# EAGLE design DACBRDV31 (EAGLE 5.07)
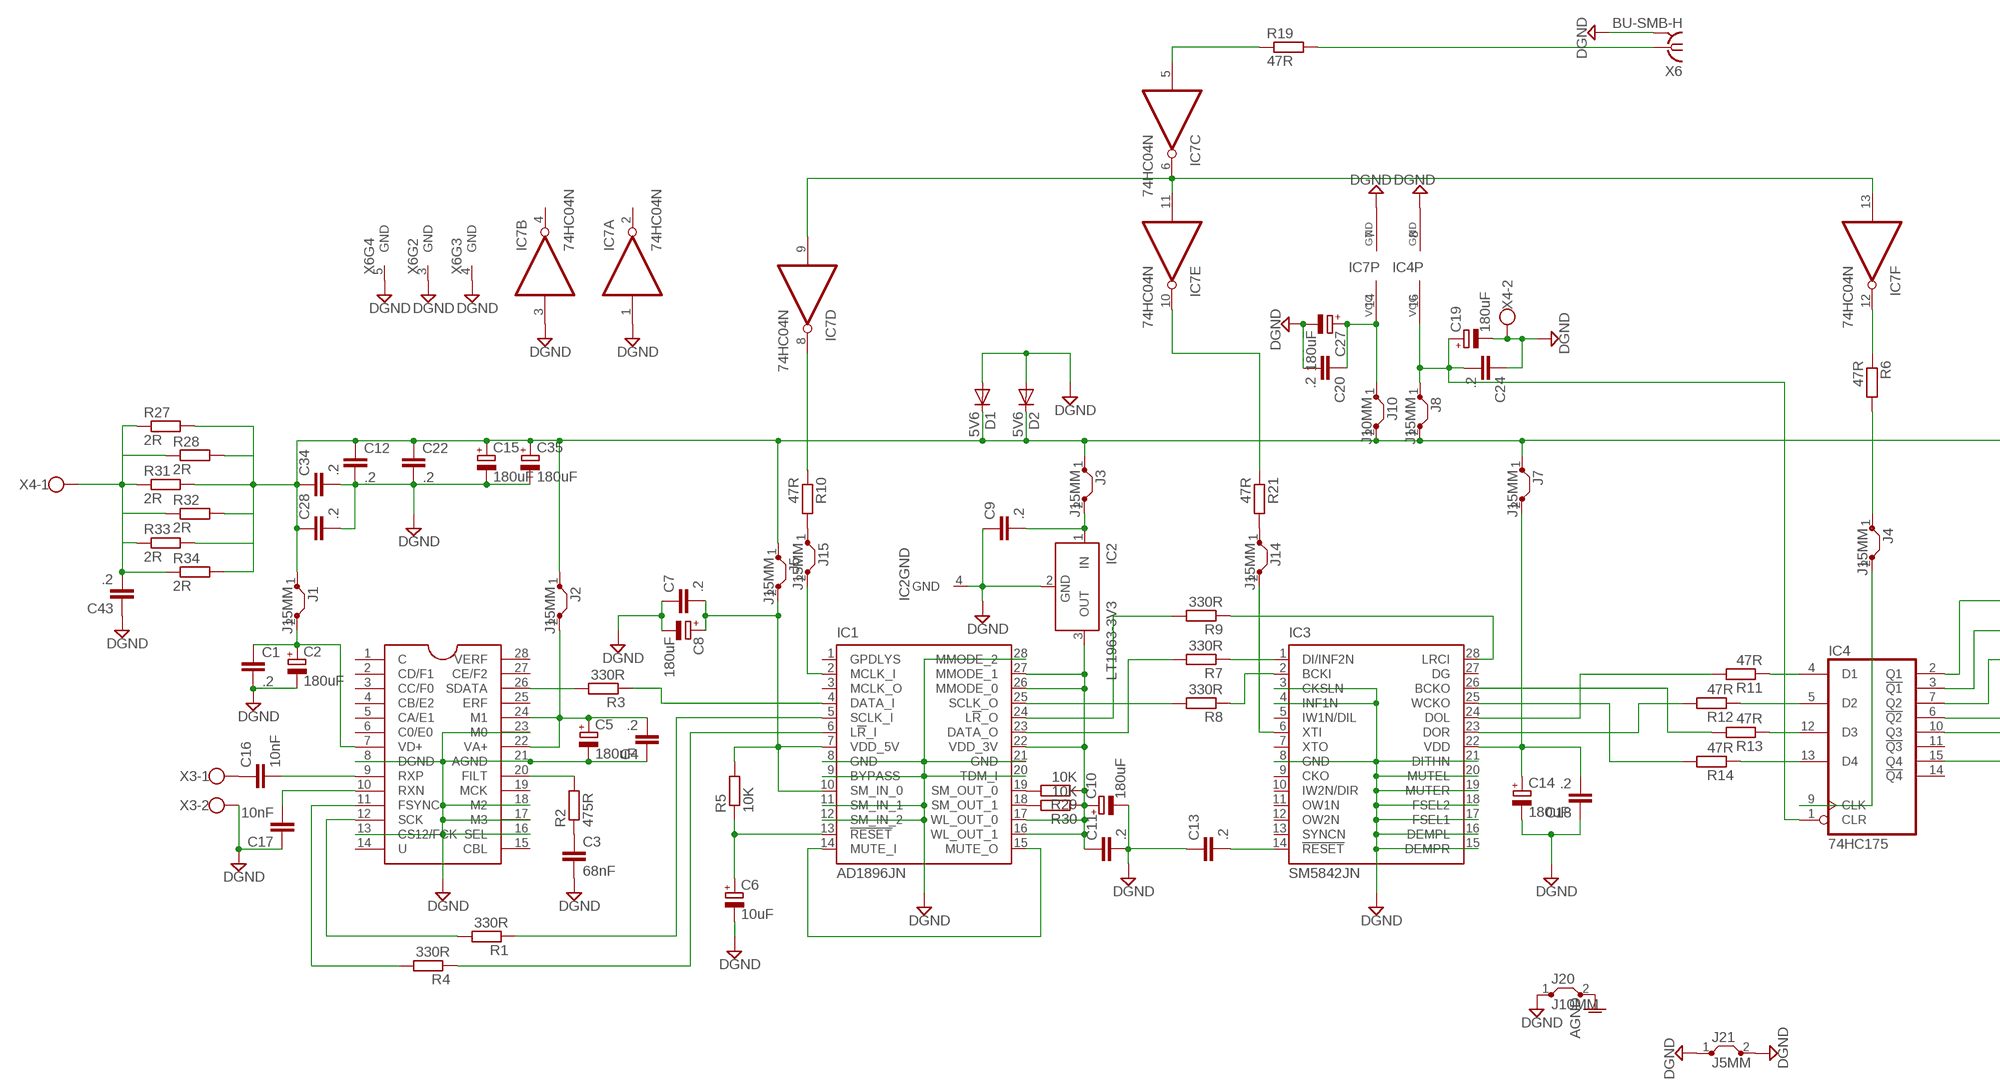
[diagram p0: schematic, sheet 1, part 1 of 2]
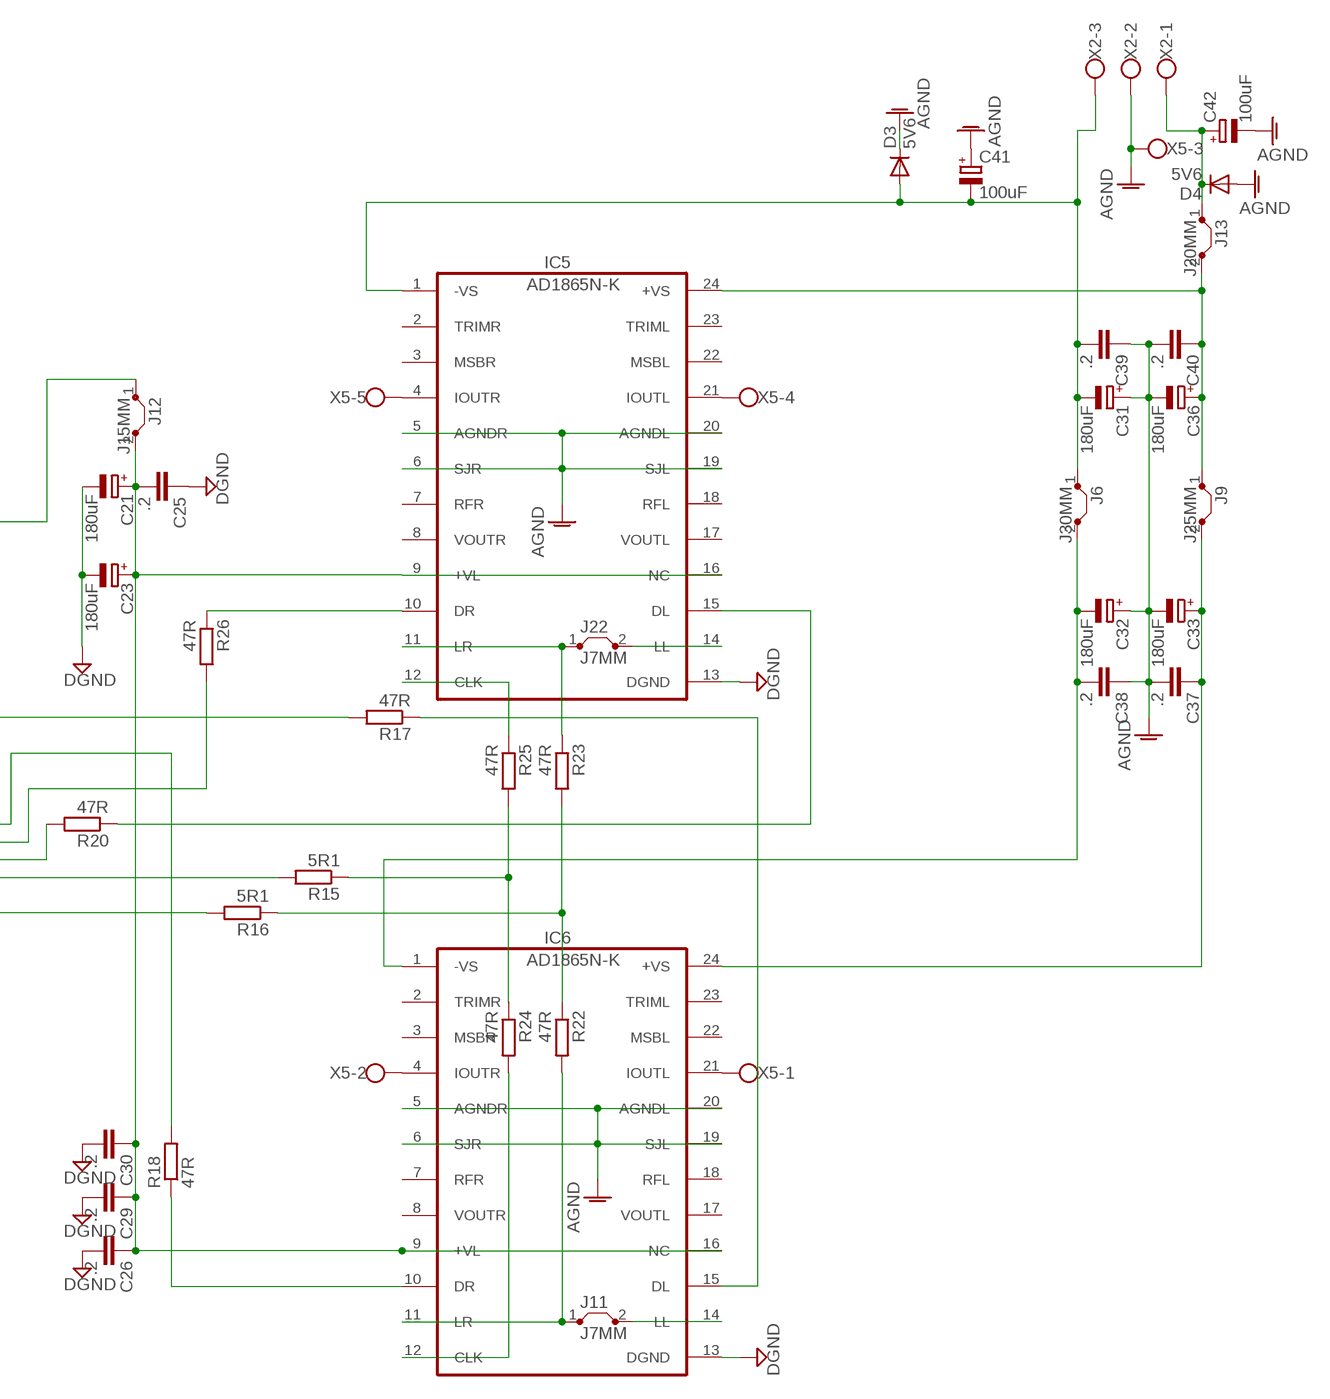
[diagram p1: schematic, sheet 1, part 2 of 2]

## Parts
C1  .2  C-EUC1210K  [C1210K]
C2  180uF  CPOL-EUE3.5-8  [E3,5-8]
C3  68nF  C-EU050-075X075  [C050-075X075]
C4  .2  C-EUC1210K  [C1210K]
C5  180uF  CPOL-EUE3.5-8  [E3,5-8]
C6  10uF  CPOL-EUE3.5-8  [E3,5-8]
C7  .2  C-EUC1210K  [C1210K]
C8  180uF  CPOL-EUE3.5-8  [E3,5-8]
C9  .2  C-EUC1210K  [C1210K]
C10  180uF  CPOL-EUE3.5-8  [E3,5-8]
C11  .2  C-EUC1210K  [C1210K]
C12  .2  C-EUC1210K  [C1210K]
C13  .2  C-EUC1210K  [C1210K]
C14  180uF  CPOL-EUE3.5-8  [E3,5-8]
C15  180uF  CPOL-EUE3.5-8  [E3,5-8]
C16  10nF  C-EU050-055X075  [C050-055X075]
C17  10nF  C-EU050-055X075  [C050-055X075]
C18  .2  C-EUC1210K  [C1210K]
C19  180uF  CPOL-EUE3.5-8  [E3,5-8]
C20  .2  C-EUC1210K  [C1210K]
C21  180uF  CPOL-EUE3.5-8  [E3,5-8]
C22  .2  C-EUC1210K  [C1210K]
C23  180uF  CPOL-EUE3.5-8  [E3,5-8]
C24  .2  C-EUC1210K  [C1210K]
C25  .2  C-EUC1210K  [C1210K]
C26  .2  C-EUC1210K  [C1210K]
C27  180uF  CPOL-EUE3.5-8  [E3,5-8]
C28  .2  C-EUC1210K  [C1210K]
C29  .2  C-EUC1210K  [C1210K]
C30  .2  C-EUC1210K  [C1210K]
C31  180uF  CPOL-EUE3.5-8  [E3,5-8]
C32  180uF  CPOL-EUE3.5-8  [E3,5-8]
C33  180uF  CPOL-EUE3.5-8  [E3,5-8]
C34  .2  C-EUC1210K  [C1210K]
C35  180uF  CPOL-EUE3.5-8  [E3,5-8]
C36  180uF  CPOL-EUE3.5-8  [E3,5-8]
C37  .2  C-EUC1210K  [C1210K]
C38  .2  C-EUC1210K  [C1210K]
C39  .2  C-EUC1210K  [C1210K]
C40  .2  C-EUC1210K  [C1210K]
C41  100uF  CPOL-EUE5-10.5  [E5-10,5]
C42  100uF  CPOL-EUE5-10.5  [E5-10,5]
C43  .2  C-EUC1210K  [C1210K]
D1  5V6  A114  [DO204-10]
D2  5V6  A114  [DO204-10]
D3  5V6  A114  [DO204-10]
D4  5V6  A114  [DO204-10]
IC1  AD1896JN  [DIL28-6]
IC2  LT1963-3V3  LT1129CST5  [SOT223]
IC3  SM5842JN  [DIL28-6]
IC4  74HC175  74175N  [DIL16]
IC5  AD1865N-K  AD1865  [DIL24-6]
IC6  AD1865N-K  AD1865  [DIL24-6]
IC7  74HC04N  7404N  [DIL14]
J1  J15MM  [15]
J2  J15MM  [15]
J3  J15MM  [15]
J4  J15MM  [15]
J5  J15MM  [15]
J6  J30MM  [30]
J7  J15MM  [15]
J8  J15MM  [15]
J9  J25MM  [25]
J10  J10MM  [10]
J11  J7MM  [07]
J12  J15MM  [15]
J13  J20MM  [20]
J14  J15MM  [15]
J15  J15MM  [15]
J20  J10MM  [10]
J21  J5MM  [05]
J22  J7MM  [07]
R1  330R  R-EU_0207/12  [0207/12]
R2  475R  R-EU_0204/7  [0204/7]
R3  330R  R-EU_0207/10  [0207/10]
R4  330R  R-EU_0207/12  [0207/12]
R5  10K  R-EU_0204/7  [0204/7]
R6  47R  R-EU_0207/12  [0207/12]
R7  330R  R-EU_0204/7  [0204/7]
R8  330R  R-EU_0207/10  [0207/10]
R9  330R  R-EU_0207/15  [0207/15]
R10  47R  R-EU_0204/7  [0204/7]
R11  47R  R-EU_0204/7  [0204/7]
R12  47R  R-EU_0207/10  [0207/10]
R13  47R  R-EU_0204/7  [0204/7]
R14  47R  R-EU_0204/7  [0204/7]
R15  5R1  R-EU_0204/7  [0204/7]
R16  5R1  R-EU_0204/7  [0204/7]
R17  47R  R-EU_0207/10  [0207/10]
R18  47R  R-EU_0207/10  [0207/10]
R19  47R  R-EU_0207/10  [0207/10]
R20  47R  R-EU_0207/12  [0207/12]
R21  47R  R-EU_0204/7  [0204/7]
R22  47R  R-EU_0207/12  [0207/12]
R23  47R  R-EU_0207/15  [0207/15]
R24  47R  R-EU_0207/12  [0207/12]
R25  47R  R-EU_0207/15  [0207/15]
R26  47R  R-EU_0207/12  [0207/12]
R27  2R  R-EU_0207/10  [0207/10]
R28  2R  R-EU_0207/10  [0207/10]
R29  10K  R-EU_M1206  [M1206]
R30  10K  R-EU_M1206  [M1206]
R31  2R  R-EU_0207/10  [0207/10]
R32  2R  R-EU_0207/10  [0207/10]
R33  2R  R-EU_0207/10  [0207/10]
R34  2R  R-EU_0207/10  [0207/10]
U$1  CS8414  CS8414DIP  [DIL28]
X2  W237-03P  [W237-133]
X3  W237-02P  [W237-132]
X4  W237-02P  [W237-132]
X5  W237-05P  [W237-5P]
X6  BU-SMB-H  [BU-SMB-H]

## Nets
AGND: C31.+ C32.+ C33.- C36.- C37.2 C38.1 C39.1 C40.2 C41.+ C42.- D3.C D4.A IC5.5(AGNDR) IC5.6(SJR) IC5.19(SJL) IC5.20(AGNDL) IC6.5(AGNDR) IC6.6(SJR) IC6.19(SJL) IC6.20(AGNDL) J20.2 X2.2 X5.3
DGND: C1.2 C2.- C3.2 C4.1 C5.- C6.- C7.1 C8.- C9.1 C10.- C11.2 C12.2 C13.1 C14.- C15.- C17.1 C18.1 C19.- C20.2 C21.- C22.2 C23.- C24.1 C25.1 C26.2 C27.- C28.2 C29.2 C30.2 C34.2 C35.- C43.1 D1.A D2.A IC1.8(GND) IC1.9(BYPASS) IC1.11(SM_IN_1) IC1.12(SM_IN_2) IC1.20(TDM_I) IC1.21(GND) IC1.28(MMODE_2) IC2.2(GND) IC2.4(GND) IC3.3(CKSLN) IC3.4(INF1N) IC3.8(GND) IC3.15(DEMPR) IC3.16(DEMPL) IC3.17(FSEL1) IC3.18(FSEL2) IC3.19(MUTER) IC3.20(MUTEL) IC3.21(DITHN) IC4.8(GND) IC5.13(DGND) IC6.13(DGND) IC7.1(A:I) IC7.3(B:I) IC7.7(P:GND) J20.1 J21.1 J21.2 U$1.8(DGND) U$1.13(CS12/FCK) U$1.16(SEL) U$1.17(M3) U$1.18(M2) U$1.21(AGND) U$1.23(M0) X3.2 X4.2 X6.2(GND) X6.3(GND) X6.4(GND) X6.5(GND)
N$1: R2.2 U$1.20(FILT)
N$2: IC1.14(MUTE_I) IC1.15(MUTE_O)
N$3: C3.1 R2.1
N$5: IC1.4(DATA_I) R3.1
N$6: IC1.5(SCLK_I) R1.1
N$7: IC1.6(L!R!_I) R4.1
N$8: C10.+ C11.1 IC1.16(WL_OUT_1) IC1.17(WL_OUT_0) IC1.22(VDD_3V) IC1.26(MMODE_0) IC1.27(MMODE_1) IC2.3(OUT) R29.1 R30.1
N$9: C7.2 C8.+ IC1.7(VDD_5V) IC1.10(SM_IN_0) J5.2 R5.2
N$10: C6.+ IC1.13(!RESET) R5.1
N$11: C9.2 IC2.1(IN) J3.2
N$12: IC1.2(MCLK_I) J15.2
N$14: IC7.8(D:O) R10.1
N$15: IC7.12(F:O) R6.1
N$16: C20.1 C27.+ IC7.14(P:VCC) J10.1
N$17: IC3.6(XTI) J14.2
N$18: IC3.1(DI/INF2N) R7.1
N$19: R3.2 U$1.26(SDATA)
N$20: IC3.2(BCKI) R8.1
N$21: IC1.23(DATA_O) R7.2
N$22: IC1.25(SCLK_O) R8.2
N$23: C17.2 U$1.10(RXN)
N$24: C16.2 U$1.9(RXP)
N$25: C16.1 X3.1
N$26: IC1.24(L!R!_O) R9.2
N$27: IC3.28(LRCI) R9.1
N$28: IC7.10(E:O) R21.1
N$29: C13.2 IC3.14(!RESET)
N$30: C14.+ C18.2 IC3.22(VDD) J7.2
N$31: IC3.26(BCKO) R13.2
N$32: C4.2 C5.+ J2.2 U$1.22(VA+) U$1.24(M1)
N$33: R4.2 U$1.11(FSYNC)
N$34: R1.2 U$1.12(SCK)
N$35: C19.+ C24.2 IC4.1(CLR) IC4.16(VCC) J8.1
N$36: IC3.24(DOL) R11.2
N$37: IC3.23(DOR) R12.2
N$38: IC4.4(D1) R11.1
N$39: C1.1 C2.+ J1.2 U$1.7(VD+)
N$40: IC4.5(D2) R12.1
N$41: IC4.12(D3) R13.1
N$44: IC4.13(D4) R14.1
N$45: IC3.25(WCKO) R14.2
N$47: IC4.10(Q3) R15.2
N$48: IC4.15(Q4) R16.2
N$49: IC4.2(Q1) R17.2
N$50: IC4.3(!Q1) R18.2
N$51: IC5.10(DR) R26.1
N$52: IC4.6(!Q2) R20.2
N$53: IC4.9(CLK) J4.2
N$54: J4.1 R6.2
N$55: IC6.11(LR) J11.1 R22.2
N$56: IC5.11(LR) J22.1 R23.1
N$57: R16.1 R22.1 R23.2
N$58: R15.1 R24.1 R25.2
N$59: IC5.12(CLK) R25.1
N$60: IC6.12(CLK) R24.2
N$61: IC7.6(C:O) IC7.9(D:I) IC7.11(E:I) IC7.13(F:I)
N$62: C21.+ C23.+ C25.2 C26.1 C29.1 C30.1 IC5.9(+VL) IC5.16(NC) IC6.9(+VL) IC6.16(NC) J12.2
N$63: IC5.15(DL) R20.1
N$64: IC6.10(DR) R18.1
N$65: IC4.7(Q2) R26.2
N$66: IC6.15(DL) R17.1
N$67: J15.1 R10.2
N$68: IC6.14(LL) J11.2
N$69: IC7.5(C:I) R19.1
N$70: C32.- C38.2 IC6.1(-VS) J6.2
N$71: IC5.14(LL) J22.2
N$72: J14.1 R21.2
N$73: C33.+ C37.1 IC6.24(+VS) J9.2
N$74: C31.- C39.2 C41.- D3.A IC5.1(-VS) J6.1 X2.3
N$75: C36.+ C40.1 IC5.24(+VS) J9.1 J13.2
N$76: IC5.4(IOUTR) X5.5
N$77: C42.+ D4.C J13.1 X2.1
N$78: IC5.21(IOUTL) X5.4
N$79: IC6.21(IOUTL) X5.1
N$80: IC6.4(IOUTR) X5.2
N$81: C43.2 R27.1 R28.1 R31.1 R32.1 R33.1 R34.1 X4.1
N$82: C12.1 C15.+ C22.1 C28.1 C34.1 C35.+ D1.C D2.C J1.1 J2.1 J3.1 J5.1 J7.1 J8.2 J10.2 J12.1 R27.2 R28.2 R31.2 R32.2 R33.2 R34.2
N$83: R19.2 X6.1
N$84: IC1.19(SM_OUT_0) R29.2
N$85: IC1.18(SM_OUT_1) R30.2
Unconnected: IC1.1(GPDLYS) IC1.3(MCLK_O) IC3.5(IW1N/DIL) IC3.7(XTO) IC3.9(CKO) IC3.10(IW2N/DIR) IC3.11(OW1N) IC3.12(OW2N) IC3.13(SYNCN) IC3.27(DG) IC4.11(!Q3) IC4.14(!Q4) IC5.2(TRIMR) IC5.3(MSBR) IC5.7(RFR) IC5.8(VOUTR) IC5.17(VOUTL) IC5.18(RFL) IC5.22(MSBL) IC5.23(TRIML) IC6.2(TRIMR) IC6.3(MSBR) IC6.7(RFR) IC6.8(VOUTR) IC6.17(VOUTL) IC6.18(RFL) IC6.22(MSBL) IC6.23(TRIML) IC7.2(A:O) IC7.4(B:O) U$1.1(C) U$1.2(CD/F1) U$1.3(CC/F0) U$1.4(CB/E2) U$1.5(CA/E1) U$1.6(C0/E0) U$1.14(U) U$1.15(CBL) U$1.19(MCK) U$1.25(ERF) U$1.27(CE/F2) U$1.28(VERF)

## Library data of the parts
C1 C3 C4 C7 C9 C11-C13 C16-C18 C20 C22 C24-C26 C28-C30 C34 C37-C40 C43 = resistor:C-EU: CAPACITOR, European symbol
C2 C5 C6 C8 C10 C14 C15 C19 C21 C23 C27 C31-C33 C35 C36 C41 C42 = resistor:CPOL-EU: POLARIZED CAPACITOR, European symbol
D1-D4 = diode:A114: DIODE germanium
IC1 = analog-devices:AD1896: Stereo Asynchronous Sample Rate Converter Auto generated by make-symbol-device-package-bsdl.ulp Rev. 33 Source: http://www.analog.com/static/imported-files/data_sheets/AD1896.pdf
IC2 = linear-technology:LT1129CST5: VOLTAGE REGULATOR with shutdown
IC3 = analog-devices:SM5842: High-Class Audio Multi-function Digital Filter Source: http://www.dddac.de/files/SM5842.pdf
IC4 = 74xx-us:74*175: Qadruple D type FLIP FLOP, clear
IC5 IC6 = pavouk:AD1865: Complete Dual 18-Bit 16xFS Audio DAC
IC7 = 74xx-us:74*04: Hex INVERTER
J1-J15 J20-J22 = jumper:J: Bridge
R1-R34 = resistor:R-EU_: RESISTOR, European symbol
U$1 = cirrus-dar:CS8414: 24bit 96kHz Digital Audio Receiver
X2 = con-wago-508:W237-03P: WAGO SREW CLAMP
X3 X4 = con-wago-508:W237-02P: WAGO SREW CLAMP
X5 = con-wago-508:W237-05P: WAGO SREW CLAMP
X6 = con-coax:BU-SMB-H: FEMALE SMB CONNECTOR Radiall distributor RS 112-3003

## Board
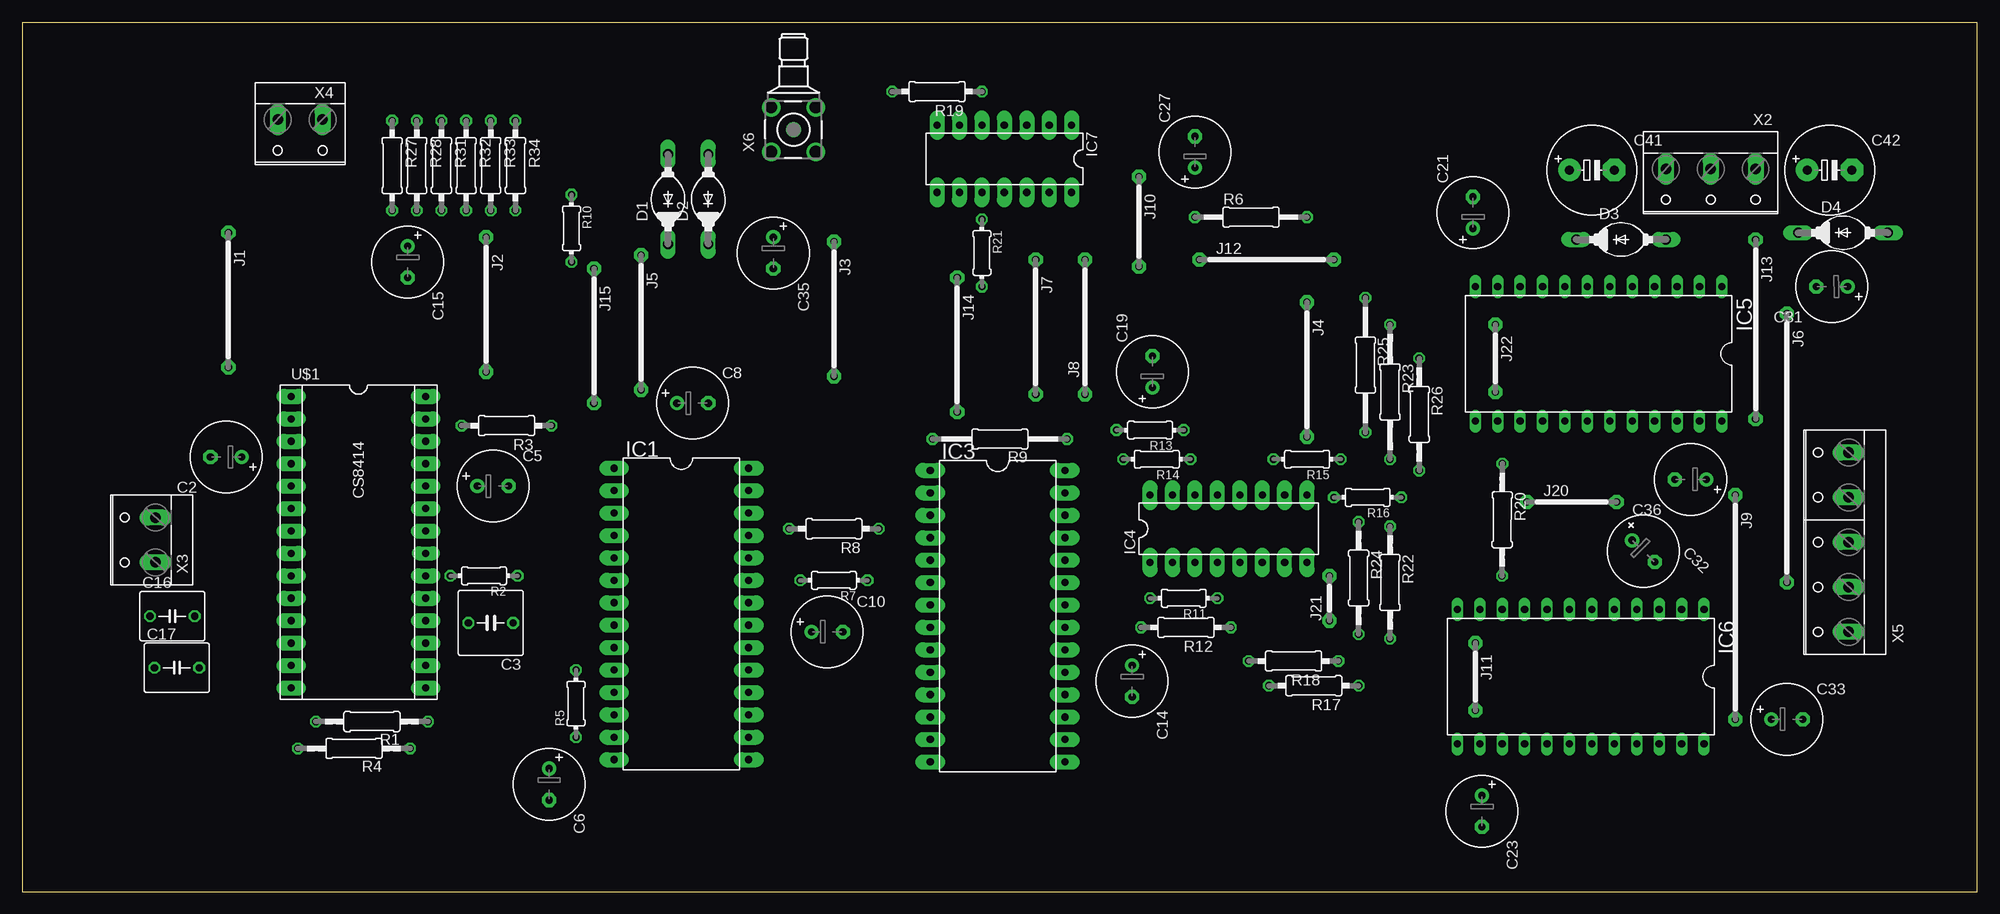
[diagram p2: board, top side]
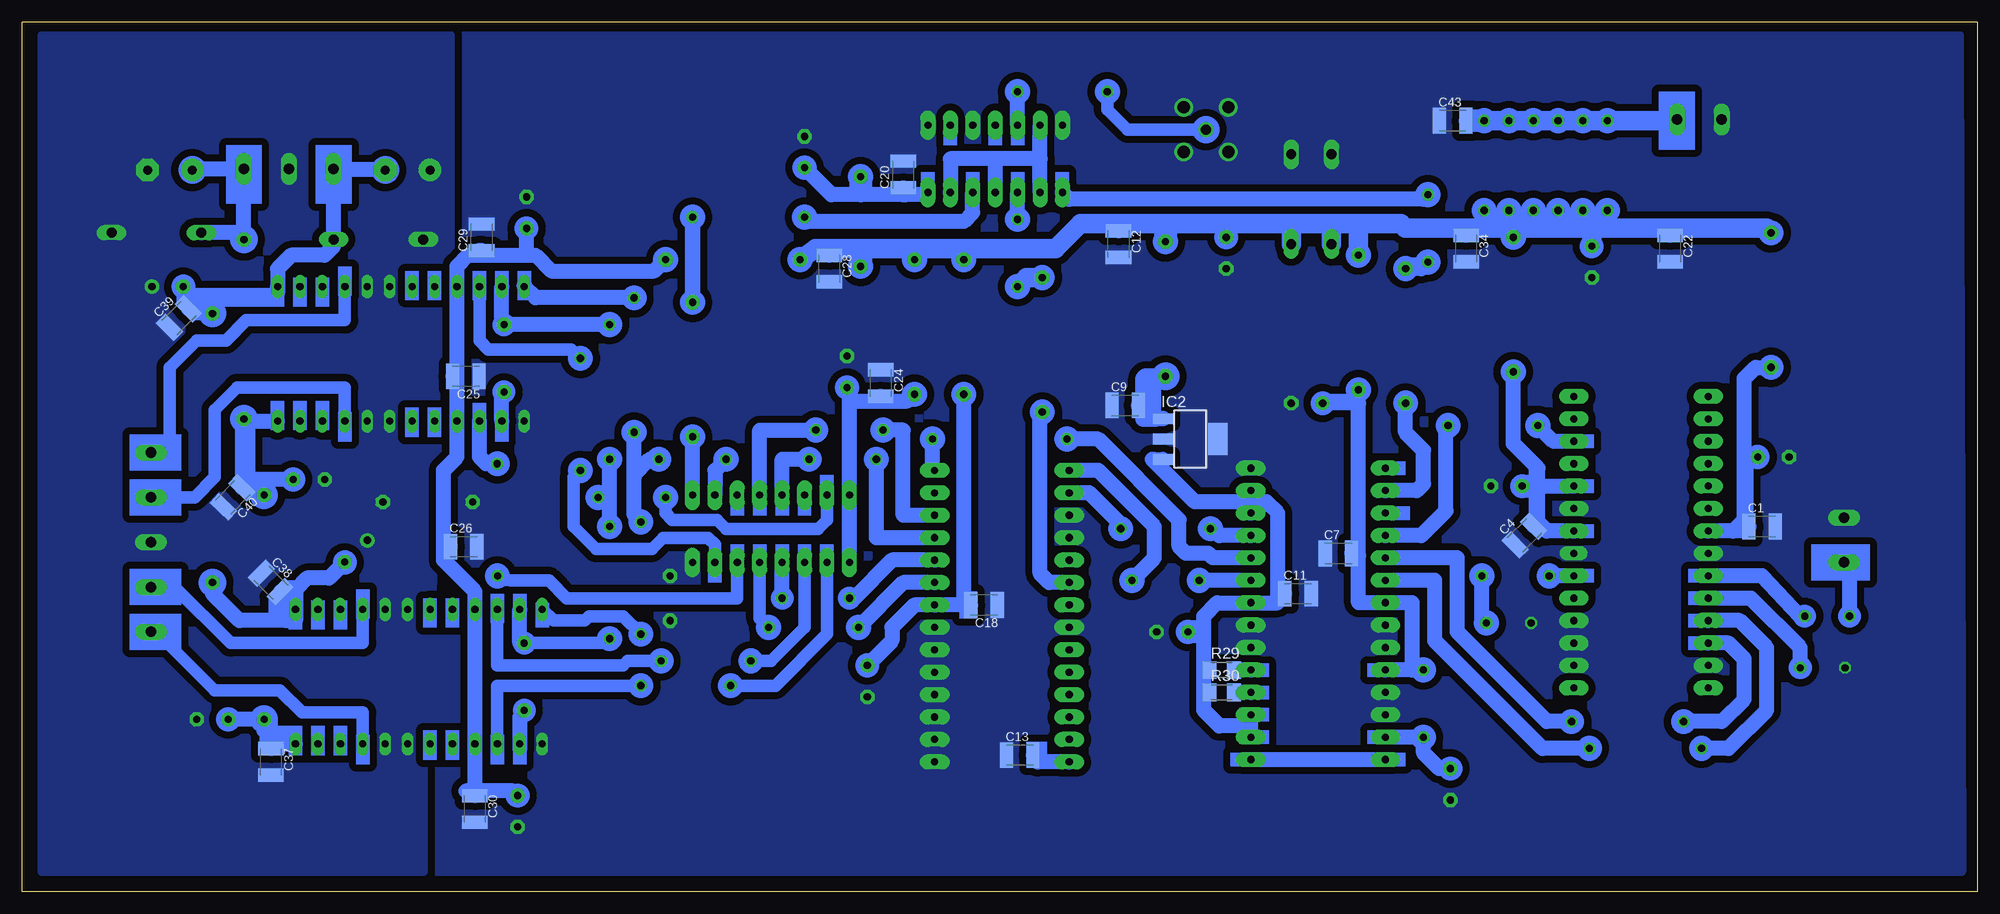
[diagram p3: board, bottom side, seen from below]

Size 221.47 x 98.55 mm. Coordinates in mm from the lower left corner, seen from the top.
Outline: 221.47,98.55 221.47,0 0,0 0,98.55 221.47,98.55
Copper layers (2*16): Route2 0.035mm / dielectric 0.15mm / Bottom 0.035mm
Design rules "default *": minimum track width 10mil, minimum drill 24mil, track to track 8mil, track to pad 8mil, pad to pad 8mil, via to via 8mil, smd to smd 8mil, copper to edge 30mil, drill to drill 8mil, minimum pad ring 10mil, minimum via ring 8mil, stop-mask expansion 4mil, vias tented up to drill 0mil, thermal gap 10mil

### Footprints (pad centres in the part's own frame; a part is rotated, then mirrored left to right if it is on the bottom)
C1210K = smd 1.5 x 2.9: 1 -1.5,0; 2 1.5,0
E3,5-8 = drill 0.813 pad 1.6 round: + -1.778,0 | drill 0.813 pad 1.6 octagon: - 1.778,0
C050-075X075 = drill 0.813 octagon: 1 -2.54,0; 2 2.54,0
C050-055X075 = drill 0.813 octagon: 1 -2.54,0; 2 2.54,0
E5-10,5 = drill 1.016 pad 2.54 round: + -2.54,0 | drill 1.016 pad 2.54 octagon: - 2.54,0
DO204-10 = drill 1.118 long: A 5.08,0; C -5.08,0
DIL28-6 = drill 0.813 pad 1.676 long: 1 -16.51,-7.62; 2 -13.97,-7.62; 3 -11.43,-7.62; 4 -8.89,-7.62; 5 -6.35,-7.62; 6 -3.81,-7.62; 7 -1.27,-7.62; 8 1.27,-7.62; 9 3.81,-7.62; 10 6.35,-7.62; 11 8.89,-7.62; 12 11.43,-7.62; 13 13.97,-7.62; 14 16.51,-7.62; 15 16.51,7.62; 16 13.97,7.62; 17 11.43,7.62; 18 8.89,7.62; 19 6.35,7.62; 20 3.81,7.62; 21 1.27,7.62; 22 -1.27,7.62; 23 -3.81,7.62; 24 -6.35,7.62; 25 -8.89,7.62; 26 -11.43,7.62; 27 -13.97,7.62; 28 -16.51,7.62
SOT223 = smd 1.219 x 2.235: 1 -2.311,-3.099; 2 0,-3.099; 3 2.311,-3.099 | smd 3.6 x 2.2: 4 0,3.099
DIL16 = drill 0.813 pad 1.676 long: 1 -8.89,-3.81; 2 -6.35,-3.81; 3 -3.81,-3.81; 4 -1.27,-3.81; 5 1.27,-3.81; 6 3.81,-3.81; 7 6.35,-3.81; 8 8.89,-3.81; 9 8.89,3.81; 10 6.35,3.81; 12 1.27,3.81; 13 -1.27,3.81; 14 -3.81,3.81; 15 -6.35,3.81; 16 -8.89,3.81 | drill 0.8 pad 1.676 long: 11 3.81,3.81
DIL24-6 = drill 0.813 long: 1 -13.97,-7.62; 2 -11.43,-7.62; 3 -8.89,-7.62; 4 -6.35,-7.62; 5 -3.81,-7.62; 6 -1.27,-7.62; 7 1.27,-7.62; 8 3.81,-7.62; 9 6.35,-7.62; 10 8.89,-7.62; 11 11.43,-7.62; 12 13.97,-7.62; 13 13.97,7.62; 14 11.43,7.62; 15 8.89,7.62; 16 6.35,7.62; 17 3.81,7.62; 18 1.27,7.62; 19 -1.27,7.62; 20 -3.81,7.62; 21 -6.35,7.62; 22 -8.89,7.62; 23 -11.43,7.62; 24 -13.97,7.62
DIL14 = drill 0.813 pad 1.676 long: 1 -7.62,-3.81; 2 -5.08,-3.81; 3 -2.54,-3.81; 4 0,-3.81; 5 2.54,-3.81; 6 5.08,-3.81; 7 7.62,-3.81; 8 7.62,3.81; 9 5.08,3.81; 10 2.54,3.81; 11 0,3.81; 12 -2.54,3.81; 13 -5.08,3.81; 14 -7.62,3.81
15 = drill 0.813 pad 1.6 octagon: 1 -7.62,0; 2 7.62,0
30 = drill 0.813 pad 1.6 octagon: 1 -15.24,0; 2 15.24,0
25 = drill 0.813 pad 1.6 octagon: 1 -12.7,0; 2 12.7,0
10 = drill 0.813 pad 1.6 octagon: 1 -5.08,0; 2 5.08,0
07 = drill 0.813 pad 1.6 octagon: 1 -3.81,0; 2 3.81,0
20 = drill 0.813 pad 1.6 octagon: 1 -10.16,0; 2 10.16,0
05 = drill 0.813 pad 1.6 octagon: 1 -2.54,0; 2 2.54,0
0207/12 = drill 0.813 octagon: 1 -6.35,0; 2 6.35,0
0204/7 = drill 0.813 octagon: 1 -3.81,0; 2 3.81,0
0207/10 = drill 0.813 octagon: 1 -5.08,0; 2 5.08,0
0207/15 = drill 0.813 octagon: 1 -7.62,0; 2 7.62,0
M1206 = smd 1.6 x 2: 1 -1.4,0; 2 1.4,0
DIL28 = drill 0.813 pad 1.676 long: 1 -16.51,-7.62; 2 -13.97,-7.62; 3 -11.43,-7.62; 4 -8.89,-7.62; 5 -6.35,-7.62; 6 -3.81,-7.62; 7 -1.27,-7.62; 8 1.27,-7.62; 9 3.81,-7.62; 10 6.35,-7.62; 11 8.89,-7.62; 12 11.43,-7.62; 13 13.97,-7.62; 14 16.51,-7.62; 15 16.51,7.62; 16 13.97,7.62; 17 11.43,7.62; 18 8.89,7.62; 19 6.35,7.62; 20 3.81,7.62; 22 -1.27,7.62; 23 -3.81,7.62; 24 -6.35,7.62; 25 -8.89,7.62; 26 -11.43,7.62; 27 -13.97,7.62; 28 -16.51,7.62 | drill 0.813 pad 1.6 long: 21 1.27,7.62
W237-133 = drill 1.194 long: 1 -5.08,-0.635; 2 0,-0.635; 3 5.08,-0.635
W237-132 = drill 1.194 long: 1 -2.54,-0.635; 2 2.54,-0.635
W237-5P = drill 1.194 long: 1 -10.16,-0.635; 2 -5.08,-0.635; 3 0,-0.635; 4 5.08,-0.635; 5 10.16,-0.635
BU-SMB-H = drill 1.1 round: 1 0,0 | drill 1.4 round: 2 -2.54,2.54; 3 2.54,2.54; 4 2.54,-2.54; 5 -2.54,-2.54

### Placement (x,y rotation side)
C1  24.38,41.4 0 bottom
C2  23.11,49.28 180 top
C3  53.09,30.48 180 top
C4  51.31,40.39 44.9 bottom
C5  53.34,45.97 0 top
C6  59.69,12.19 270 top
C7  72.39,38.35 0 bottom
C8  75.95,55.37 0 top
C9  96.52,55.12 0 bottom
C10  91.19,29.46 0 top
C11  76.96,33.78 0 bottom
C12  97.28,73.41 270 bottom
C13  108.46,15.49 0 bottom
C14  125.73,23.88 270 top
C15  43.69,71.37 270 top
C16  17.02,31.24 0 top
C17  17.53,25.4 0 top
C18  112.52,32.51 180 bottom
C19  128.02,58.93 90 top
C20  121.67,81.28 90 bottom
C21  164.34,76.96 90 top
C22  34.8,72.9 270 bottom
C23  165.35,9.14 270 top
C24  124.21,57.66 270 bottom
C25  171.2,58.42 180 bottom
C26  171.45,39.12 359.9 bottom
C27  132.84,83.82 90 top
C28  130.05,70.61 270 bottom
C29  169.42,74.17 90 bottom
C30  170.18,9.4 270 bottom
C31  204.98,68.58 180.2 top
C32  183.64,38.61 316.1 top
C33  199.9,19.56 0 top
C34  57.91,72.9 270 bottom
C35  85.09,72.39 270 top
C36  188.98,46.74 180 top
C37  193.29,14.73 270 bottom
C38  193.29,35.05 315 bottom
C39  203.71,65.02 44.9 bottom
C40  197.61,44.7 226 bottom
C41  177.8,81.79 0 top
C42  204.72,81.79 0 top
C43  59.44,87.38 0 bottom
D1  73.15,78.49 90 top
D2  77.72,78.49 90 top
D3  181.1,73.91 0 top
D4  206.25,74.68 0 top
IC1  74.68,31.5 270 top
IC2  89.15,51.31 270 bottom
IC3  110.49,31.24 270 top
IC4  136.65,41.15 0 top
IC5  178.56,60.96 180 top
IC6  176.53,24.38 180 top
IC7  111.25,83.06 180 top
J1  23.37,67.06 270 top
J2  52.58,66.55 270 top
J3  91.95,66.04 270 top
J4  145.54,59.18 270 top
J5  70.1,64.52 270 top
J6  199.9,50.29 270 top
J7  114.81,64.01 270 top
J8  120.4,64.01 90 top
J9  194.06,32.26 270 top
J10  126.49,75.95 270 top
J11  164.59,24.38 270 top
J12  140.97,71.63 0 top
J13  196.34,63.75 270 top
J14  105.92,61.98 270 top
J15  64.77,62.99 270 top
J20  175.51,44.2 0 top
J21  148.08,33.27 90 top
J22  166.88,60.45 270 top
R1  39.62,19.3 180 top
R2  52.32,35.81 180 top
R3  54.86,52.83 180 top
R4  37.59,16.26 180 top
R5  62.74,21.34 90 top
R6  139.19,76.45 0 top
R7  91.95,35.31 180 top
R8  91.95,41.15 180 top
R9  110.74,51.31 180 top
R10  62.23,75.18 270 top
R11  131.57,33.27 180 top
R12  131.83,29.97 180 top
R13  127.76,52.32 180 top
R14  128.52,49.02 180 top
R15  145.54,49.02 180 top
R16  152.4,44.7 180 top
R17  146.3,23.37 180 top
R18  144.02,26.16 180 top
R19  103.63,90.68 180 top
R20  167.64,42.16 269.8 top
R21  108.71,72.39 270 top
R22  154.94,35.05 270 top
R23  154.94,56.64 270 top
R24  151.38,35.56 270 top
R25  152.15,59.69 270 top
R26  158.24,54.1 270 top
R27  41.91,82.3 270 top
R28  44.7,82.3 270 top
R29  85.6,25.15 0 bottom
R30  85.6,22.61 0 bottom
R31  47.5,82.3 270 top
R32  50.29,82.3 270 top
R33  53.09,82.3 270 top
R34  55.88,82.3 270 top
U$1  38.1,39.62 270 top
X2  191.26,81.28 180 top
X3  14.48,39.88 90 top
X4  31.5,86.87 180 top
X5  206.25,39.62 90 top
X6  87.38,86.36 90 top

### Tracks (layer width: path | path; a pad name or v marks a point on that pad's centre or on a via)
AGND
  pour Bottom (isolate 0.813, no thermals): 219.2,97.03 172.97,97.03 172.97,68.07 173.74,68.07 175.01,34.04 172.21,34.04 172.21,16 176.02,16 176.02,2.29 219.2,2.29
DGND
  pour Bottom (isolate 0.813, rank 5, no thermals): 2.03,97.03 1.78,2.29 182.37,2.29 182.88,97.03
N$1
  Bottom 1.676: U$1.20 R2.2
N$2
  Bottom 1.676: IC1.14 IC1.15
N$3
  Bottom 1.676: C3.1 56.13,30.99 R2.1
N$5
  Bottom 1.676: IC1.4 62.99,40.39 60.2,43.18 60.2,52.32 R3.1
N$6
  Bottom 1.676: R1.1 48.77,19.3 58.93,29.46 58.93,37.85 IC1.5
N$7
  Bottom 1.676: R4.1 49.28,16.26 61.47,28.45 61.47,35.31 IC1.6
N$8
  Bottom 1.676: 79.25,33.53 79.25,32.77 IC1.22 86.11,32.77 87.63,31.24 87.63,29.46 | 79.25,33.53 79.25,42.93 80.52,44.2 82.55,44.2 | 82.3,43.94 IC1.27 | 82.3,43.94 IC1.26 | 82.55,44.2 82.3,43.94 | 82.55,44.2 88.65,44.2 93.47,49.02 93.29,49.02 IC2.3 | C11.1 78.72,33.53 79.25,33.53 | IC1.16 82.3,18.8 | 82.3,18.8 IC1.17 | 82.3,18.8 85.85,18.8 87.63,20.57 87.63,22.86 | 87.63,22.86 87.63,25.15 | 87.63,25.15 87.63,29.46 | 87.63,25.15 R29.1 | R30.1 87.25,22.86 87.63,22.86 | 87.63,29.46 C10.+
N$9
  Bottom 1.676: R5.2 64.01,25.15 | 64.01,25.15 IC1.10 | 70.1,38.1 70.1,32.77 IC1.7 64.01,32.77 64.01,25.15 | 70.1,38.1 70.1,55.37 | 70.1,55.37 J5.2 | C7.2 70.64,38.1 70.1,38.1 | 70.1,55.37 C8.+
N$10
  Bottom 1.676: IC1.13 R5.1 62.74,15.75 60.96,13.97 C6.+
N$11
  Bottom 1.778: IC2.1 93.04,53.59 94.49,53.59 94.49,55.12 | 94.49,55.12 94.49,58.17 94.23,58.42 J3.2 | 94.49,55.12 C9.2
N$12
  Bottom 1.676: IC1.2 63.5,45.47 62.74,46.23 62.74,50.04 64.77,52.07 J15.2 64.77,55.12
N$14
  Bottom 1.676: R10.1 62.74,78.49 102.87,78.49 IC7.8
N$15
  Bottom 1.676: IC7.12 113.79,76.96 114.81,75.95 132.84,75.95
  Bottom 1.778: 132.84,75.95 R6.1
N$16
  Bottom 1.676: 121.67,78.99 C20.1 121.41,79.53 121.41,78.99 | IC7.14 119.13,78.99 121.41,78.99 | 121.41,78.99 121.67,78.99 | 121.67,78.99 126.49,78.99 | 126.49,78.99 J10.1 | 126.49,78.99 129.79,78.99 C27.+
N$17
  Bottom 1.676: IC3.6 105.16,35.05 106.17,36.07 106.17,54.36 J14.2
N$18
  Bottom 1.676: R7.1 93.22,37.85 93.22,41.4 99.57,47.75 IC3.1
N$19
  Bottom 1.676: U$1.26 48.01,51.05 R3.2
N$20
  Bottom 1.676: IC3.2 100.58,45.21 97.03,41.66 R8.1
N$21
  Bottom 1.676: IC1.23 R7.2
N$22
  Bottom 1.676: IC1.25 85.85,40.39 R8.2
N$23
  Bottom 1.676: U$1.10 25.65,33.27 20.07,27.69 C17.2
N$24
  Bottom 1.676: U$1.9 24.38,35.81 20.07,31.24 C16.2
N$25
  Bottom 1.676: X3.1 14.48,37.47 C16.1
N$26
  Bottom 1.676: IC1.24 86.61,37.85 87.12,38.35 89.66,38.35 90.42,39.12 90.42,42.16 99.57,51.31 R9.2
N$27
  Bottom 1.676: IC3.28 118.36,48.01 R9.1
N$28
  Bottom 1.676: R21.1 IC7.10
N$29
  Bottom 1.676: IC3.14 106.43,14.73 106.68,14.99 C13.2
N$30
  Bottom 1.676: 114.81,32.51 IC3.22 120.4,32.51 122.94,29.97 122.94,28.45 C14.+ | 114.81,32.51 J7.2 | C18.2 114.81,32.51
N$31
  Bottom 1.676: IC3.26 121.67,42.67 121.67,52.32 R13.2
N$32
  Bottom 1.676: 50.29,45.97 U$1.24 | 50.29,45.97 C5.+ | J2.2 52.58,50.8 49.78,48.01 49.78,46.23 | 49.78,46.23 49.78,41.91 49.66,41.78 | 49.66,41.78 48.77,40.89 U$1.22 | 50.29,45.97 50.04,46.23 49.78,46.23 | C4.2 49.91,41.78 49.66,41.78
N$33
  Bottom 1.676: U$1.11 26.92,30.73 23.88,27.69 23.88,20.57 28.19,16.26 R4.2
N$34
  Bottom 1.676: U$1.12 28.19,28.19 26.42,26.42 26.42,21.84 28.96,19.3 R1.2
N$35
  Bottom 1.676: IC4.1 IC4.16 127.76,55.63 | 124.21,55.63 C24.2 | J8.1 121.16,55.63 124.21,55.63 | 127.76,55.63 127.76,56.64 128.02,56.9 C19.+ | 127.76,55.63 124.21,55.63
N$36
  Bottom 1.676: R11.2 127.25,33.27 122.94,37.59 IC3.24
N$37
  Bottom 1.676: IC3.23 121.67,35.05 R12.2
N$38
  Bottom 1.676: R11.1 IC4.4 135.38,38.1
N$39
  Bottom 1.676: U$1.7 27.69,40.89 27.43,41.15 | 27.43,41.15 26.42,42.16 26.42,49.28 | 26.42,49.28 C2.+ | J1.2 25.15,59.44 26.42,58.17 26.42,49.28 | C1.1 26.14,41.15 27.43,41.15
N$40
  Bottom 1.422: IC4.5 137.92,30.99 R12.1
N$41
  Bottom 1.676: R13.1 137.92,52.32 IC4.12
N$44
  Bottom 1.676: R14.1 135.38,49.02 IC4.13
N$45
  Bottom 1.676: IC3.25 124.71,40.13 R14.2
N$47
  Bottom 1.676: R15.2 143,47.75 IC4.10
N$48
  Bottom 1.422: R16.2 148.59,42.93 147.83,42.16 142.75,42.16 141.73,41.15 131.32,41.15 130.3,42.16 IC4.15
N$49
  Bottom 1.422: IC4.2 130.3,29.21 136.14,23.37 R17.2
N$50
  Bottom 1.422: IC4.3 132.84,29.97 136.65,26.16 R18.2
N$51
  Bottom 1.422: R26.1 159.26,61.47 168.66,61.47 169.67,62.48 IC5.10
N$52
  Bottom 1.422: IC4.6 140.46,33.27 159.77,33.27 161.8,35.31 166.12,35.31 167.64,35.33 R20.2
N$53
  Bottom 1.676: IC4.9 J4.2
N$54
  Bottom 1.778: J4.1 R6.2
N$55
  Bottom 1.422: R22.2 155.45,28.19 J11.1 165.1,28.19
  Bottom 1.676: 165.1,28.19 IC6.11
N$56
  Bottom 1.422: J22.1 167.13,65.02
  Bottom 1.676: 167.13,65.02 IC5.11 | R23.1 J22.1
N$57
  Bottom 1.676: R22.1 154.94,44.7 | 154.94,44.7 R23.2 | 154.94,44.7 R16.1
N$58
  Bottom 1.676: R24.1 152.15,42.67 152.15,46.99 152.15,47.24 | 152.15,47.24 R25.2 | R15.1 150.37,49.02 152.15,47.24
N$59
  Bottom 1.676: 164.59,68.83 IC5.12 163.32,67.31 R25.1
N$60
  Bottom 1.422: R24.2 153.42,31.24 157.23,31.24 157.73,30.73 161.29,30.73 IC6.12
N$61
  Bottom 1.676: IC7.9 106.17,83.06 | IC7.13 116.33,83.06 111.25,83.06 | 106.17,83.06 111.25,83.06 | 111.25,83.06 IC7.11 | 106.17,83.06 IC7.6
N$62
  Bottom 1.676: 172.21,58.42 IC5.16 172.21,49.28 173.74,47.75 173.74,39.12 | 172.21,58.42 IC5.9 | IC5.9 | J12.2 149.86,70.36 161.54,70.36 163.32,72.14 164.34,72.14 | 169.67,72.14 170.94,72.14 172.21,70.87 IC5.9 | 169.67,72.14 164.34,72.14 | 164.34,72.14 C21.+ | 172.21,58.42 C25.2 | C29.1 169.67,72.67 169.67,72.14 | 173.74,39.12 173.74,37.59 170.18,34.04 IC6.9 IC6.16 170.18,11.43 | C26.1 173.74,39.12 | C23.+ 165.86,11.43 170.18,11.43 | 170.18,11.43 171.2,11.43 | 170.18,11.43 C30.1
N$63
  Bottom 1.676: R20.1 168.91,48.51 169.67,49.28 IC5.15
N$64
  Bottom 1.422: R18.1 152.91,26.16 153.42,25.65 167.64,25.65 IC6.10
N$65
  Bottom 1.422: IC4.7 143,39.37 143.76,40.13 148.84,40.13 150.11,38.86 156.46,38.86 159,41.4 159,46.99 R26.2
N$66
  Bottom 1.422: R17.1 167.64,23.37 IC6.15
N$67
  Bottom 1.676: R10.2 62.99,70.61 J15.1
N$68
  Bottom 1.422: 165.1,19.81 164.34,20.57 J11.2
  Bottom 1.676: 165.1,19.81 IC6.14 165.1,16.26
N$69
  Bottom 1.676: IC7.5 R19.1
N$70
  Bottom 1.676: J6.2 199.9,33.78 196.85,30.73 191.52,30.73 | 190.5,33.02 190.5,34.29 189.23,35.56 186.69,35.56 185.67,36.58 C32.- | 190.5,33.02 IC6.1 190.5,30.73 191.52,30.73 | 190.5,33.02 191.26,33.02 | C38.2 191.52,33.27 191.52,30.73
N$71
  Bottom 1.422: 167.13,56.39 J22.2
  Bottom 1.676: IC5.14 167.13,56.39
N$72
  Bottom 2.184: J14.1 107.7,69.6 R21.2
N$73
  Bottom 1.676: IC6.24 192.02,16.76 192.53,16.76 | 192.53,16.76 194.06,18.29 J9.2 C33.+ | C37.1 193.29,16.26 192.79,16.76 192.53,16.76
N$74
  Bottom 1.676: C41.- 180.47,81.91 X2.3 D3.A 186.18,73.15 187.2,72.14 191.01,72.14 192.53,70.61 IC5.1 192.53,67.82 192.79,67.56 202.44,67.56 202.69,67.82 | 202.69,67.82 203.2,68.33 C31.- | 202.18,66.55 J6.1 | 202.18,66.55 C39.2 | 202.18,66.55 202.69,67.06 202.69,67.82
N$75
  Bottom 1.676: C36.+ 194.31,46.74 | 194.31,46.74 196.34,46.74 | 196.34,46.74 196.6,46.74 196.34,46.99 J13.2 196.34,52.32 195.33,53.34 IC5.24 | J9.1 194.31,45.21 194.31,46.74 | C40.1 196.34,46.01 196.34,46.74
N$76
  Bottom 1.422: X5.5 206.25,49.78 204.72,51.31 204.72,59.44 201.68,62.48 198.37,62.48 196.09,64.77 184.91,64.77 IC5.4
N$77
  Bottom 1.676: J13.1 196.34,74.68 | 196.34,74.68 X2.1 202.06,81.91 C42.+ | 196.34,74.68 D4.C
N$78
  Bottom 1.422: IC5.21 184.91,57.15 197.1,57.15 199.64,54.61 199.64,46.99 201.93,44.7 X5.4
N$79
  Bottom 1.422: X5.1 206.25,29.46 199.64,22.86 192.28,22.86 189.74,20.32 182.88,20.32 IC6.21
N$80
  Bottom 1.422: IC6.4 182.88,28.19 197.87,28.19 204.22,34.54 X5.2
N$81
  Bottom 1.676: R27.1 41.78,87.5 | R28.1 45.21,87.38 | R34.1 C43.2
  Bottom 2.184: X4.1 34.16,87.38 R27.1 R28.1 | 45.21,87.38 R31.1 R32.1 R33.1 R34.1
N$82
  Bottom 1.676: 130.3,72.9 C28.1 | 97.28,75.69 C12.1 | 57.91,75.18 C34.1 | 34.8,74.55 C22.1 34.8,75.18
  Bottom 2.184: J12.1 131.57,72.9 130.3,72.9 126.49,72.9 | 114.81,72.9 120.4,72.9 | 120.4,72.9 126.49,72.9 | 120.4,72.9 J8.2 | 126.49,72.9 J10.2 | 114.81,72.9 J7.1 | 114.81,72.9 104.39,72.9 101.6,75.69 97.28,75.69 91.95,75.69 | 70.1,75.69 65.28,75.69 64.77,75.18 57.91,75.18 55.88,75.18 | 70.1,75.69 73.15,75.69 | 73.15,75.69 77.72,75.69 | 77.72,75.69 85.09,75.69 | 85.09,75.69 91.95,75.69 | 91.95,75.69 91.95,75.44 | 85.09,75.69 C35.+ | 73.15,75.69 D1.C | 77.72,75.69 D2.C | 91.95,75.44 J3.1 | 91.95,75.44 92.2,75.44 | 43.69,75.18 44.96,75.18 | 44.96,75.18 47.5,75.18 | 47.5,75.18 50.29,75.18 | 50.29,75.18 52.83,75.18 | 52.83,75.18 53.09,75.18 | 53.09,75.18 55.88,75.18 | J2.1 52.83,74.42 52.83,75.18 | 70.1,75.69 J5.1 | R27.2 42.16,76.96 42.16,75.18 | R28.2 44.7,75.69 44.96,75.44 44.96,75.18 | 47.5,75.18 R31.2 | 50.29,75.18 R32.2 | 53.09,75.18 R33.2 | 55.88,75.18 R34.2 | 42.16,75.18 34.8,75.18 23.88,75.18 J1.1 | 42.16,75.18 43.69,75.18 | 43.69,75.18 43.69,74.42 C15.+
N$83
  Bottom 1.422: X6.1 96.27,86.36 98.55,88.65 R19.2
N$84
  Bottom 1.676: IC1.19 R29.2
N$85
  Bottom 1.676: IC1.18 R30.2
(copper drawn outside any net)
  shapes: Bottom area x136, Bottom circle x181